# Altium schematic sheet Keyboard.SchDoc
size A4
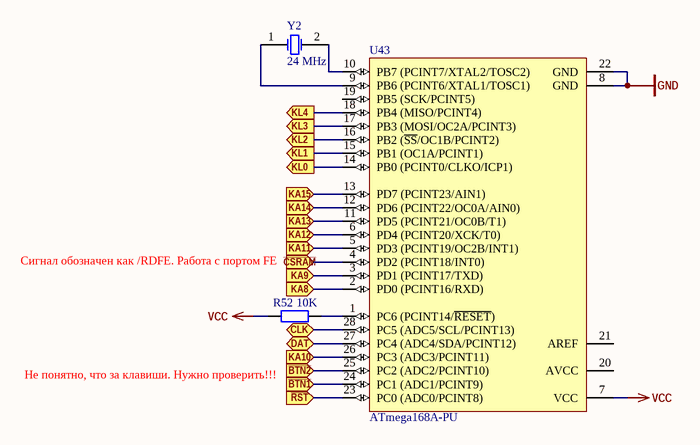
[diagram p0: Keyboard.SchDoc]

## Parts
R52  value 10K  [AXIAL-0.4]  (hidden comment: Res2)
U43  ATmega168A-PU  [28P3]
Y2  24 MHz  [HC25U]

## Ports
CLK (bidir), DAT (bidir), KA8 (in), KA9 (in), KA10 (in), KA11 (in), KA12 (in), KA13 (in), KA14 (in), KA15 (in), KL0 (out), KL1 (out), KL2 (out), KL3 (out), KL4 (out), ~{BTN1} (in), ~{BTN2} (in), ~{CSRAM} (in), ~{RST} (in)

## Nets
GND: U43.8(GND) U43.22(GND)
VCC: R52.2 U43.7(VCC)
~{BTN1}: U43.24(PC1_(ADC1/PCINT9)) ; port ~{BTN1}
~{BTN2}: U43.25(PC2_(ADC2/PCINT10)) ; port ~{BTN2}
~{CSRAM}: U43.4(PD2_(PCINT18/INT0)) ; port ~{CSRAM}
CLK: U43.28(PC5_(ADC5/SCL/PCINT13)) ; port CLK
DAT: U43.27(PC4_(ADC4/SDA/PCINT12)) ; port DAT
KA8: U43.2(PD0_(PCINT16/RXD)) ; port KA8
KA9: U43.3(PD1_(PCINT17/TXD)) ; port KA9
KA10: U43.26(PC3_(ADC3/PCINT11)) ; port KA10
KA11: U43.5(PD3_(PCINT19/OC2B/INT1)) ; port KA11
KA12: U43.6(PD4_(PCINT20/XCK/T0)) ; port KA12
KA13: U43.11(PD5_(PCINT21/OC0B/T1)) ; port KA13
KA14: U43.12(PD6_(PCINT22/OC0A/AIN0)) ; port KA14
KA15: U43.13(PD7_(PCINT23/AIN1)) ; port KA15
KL0: U43.14(PB0_(PCINT0/CLKO/ICP1)) ; port KL0
KL1: U43.15(PB1_(OC1A/PCINT1)) ; port KL1
KL2: U43.16(PB2_(~{SS}/OC1B/PCINT2)) ; port KL2
KL3: U43.17(PB3_(MOSI/OC2A/PCINT3)) ; port KL3
KL4: U43.18(PB4_(MISO/PCINT4)) ; port KL4
~{RST}: U43.23(PC0_(ADC0/PCINT8)) ; port ~{RST}
NetR52_1: R52.1 U43.1(PC6_(PCINT14/~{RESET}))
NetU43_9: U43.9(PB6_(PCINT6/XTAL1/TOSC1)) Y2.1(OSC1)
NetU43_10: U43.10(PB7_(PCINT7/XTAL2/TOSC2)) Y2.2(OSC2)

Not connected (* = marked no-connect by the designer): U43 19(PB5_(SCK/PCINT5)) 20(AVCC) 21(AREF)

## Notes on the sheet
- Сигнал обозначен как /RDFE. Работа с портом FE
- Не понятно, что за клавиши. Нужно проверить!!!

## Library data of the parts
R52 = Res2: Resistor; Published: 8-Jun-2000; LatestRevisionDate: 17-Jul-2002; LatestRevisionNote: Re-released for DXP Platform.; PackageReference: AXIAL-0.4; Publisher: Altium Limited; PackageDescription: Axial Device, Thru-Hole; 2 Leads; 0.4 in Pin Spacing
U43 = ATmega168A-PU: 8-bit AVR Microcontroller, 16KB Flash, 512 Bytes EEPROM, 1KB SRAM, 28-pin PDIP, Industrial Grade (-40°C to 85°C); Published: 1-Apr-2010; DatasheetVersion: revA, Jan-2010; PackageVersion: revB, Sep-2001; PackageReference: 28P3; Publisher: Altium Limited; PackageDescription: 28-lead (0.300"/7.62mm Wide) Plastic Dual Inline Package (PDIP); Supplier 1: Digi-Key; Supplier Part Number 1: ATMEGA168A-PU-ND; Supplier 2: Mouser; Supplier Part Number 2: 556-ATMEGA168A-PU; ComponentLink1Description: Manufacturer Link; ComponentLink1URL: http://www.atmel.com/products/avr/default.asp?; ComponentLink2Description: ATmega48A/48PA/88A/88PA/168A/168PA/328/328P Datasheet; ComponentLink2URL: http://www.atmel.com/dyn/resources/prod_documents/8271.pdf; ComponentLink3Description: ATmega48A/48PA/88A/88PA/168A/168PA/328/328P Summary; ComponentLink3URL: http://www.atmel.com/dyn/resources/prod_documents/8271S.pdf; ComponentLink4Description: Atmel.com Home; ComponentLink4URL: http://www.atmel.com
Y2 = XTAL: Crystal Oscillator; Published: 8-Jun-2000; LatestRevisionDate: 17-Jul-2002; LatestRevisionNote: Re-released for DXP Platform.; PackageReference: R38; Publisher: Altium Limited; PackageDescription: Crystal, Thru-Hole; 2 Leads; Body 3.1 x 8.2 mm (Dia.xH)